# EAGLE schematic MegaFly_rev3.1 (EAGLE 6.1)
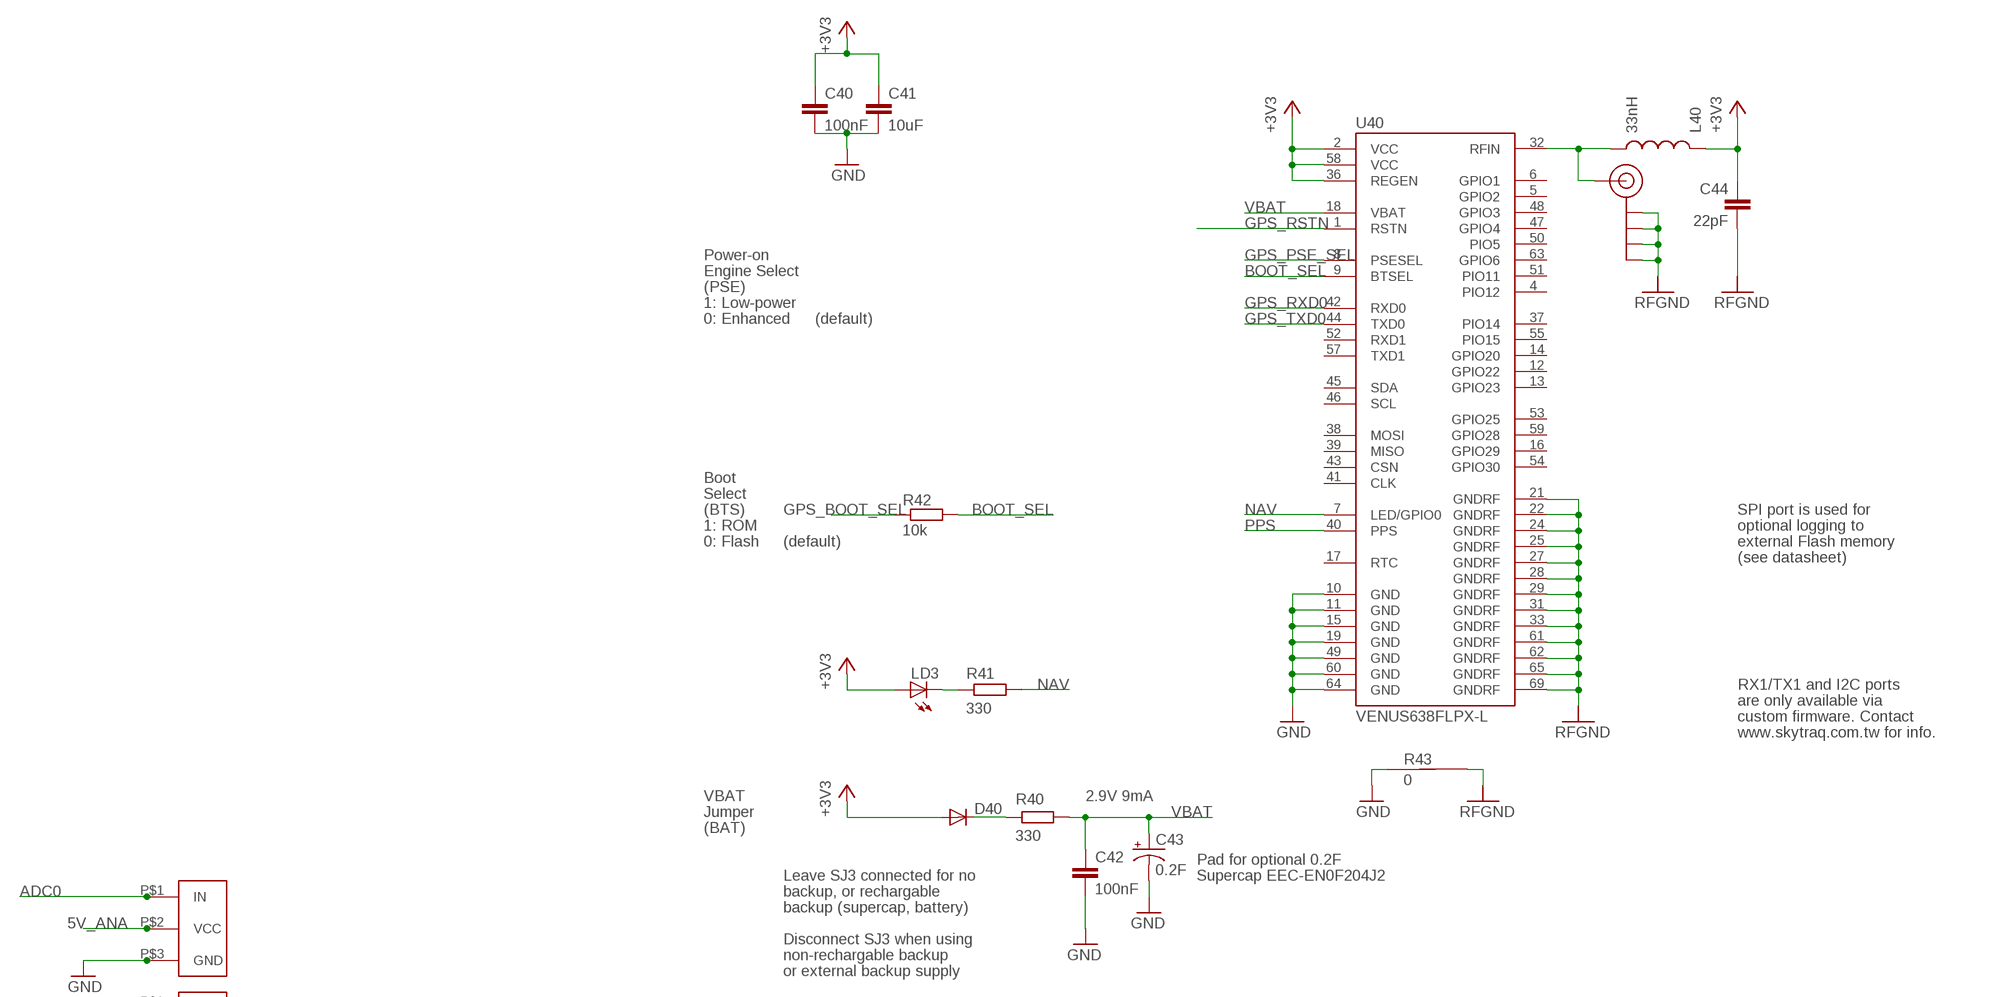
[diagram p0: schematic, sheet 1, part 1 of 3]
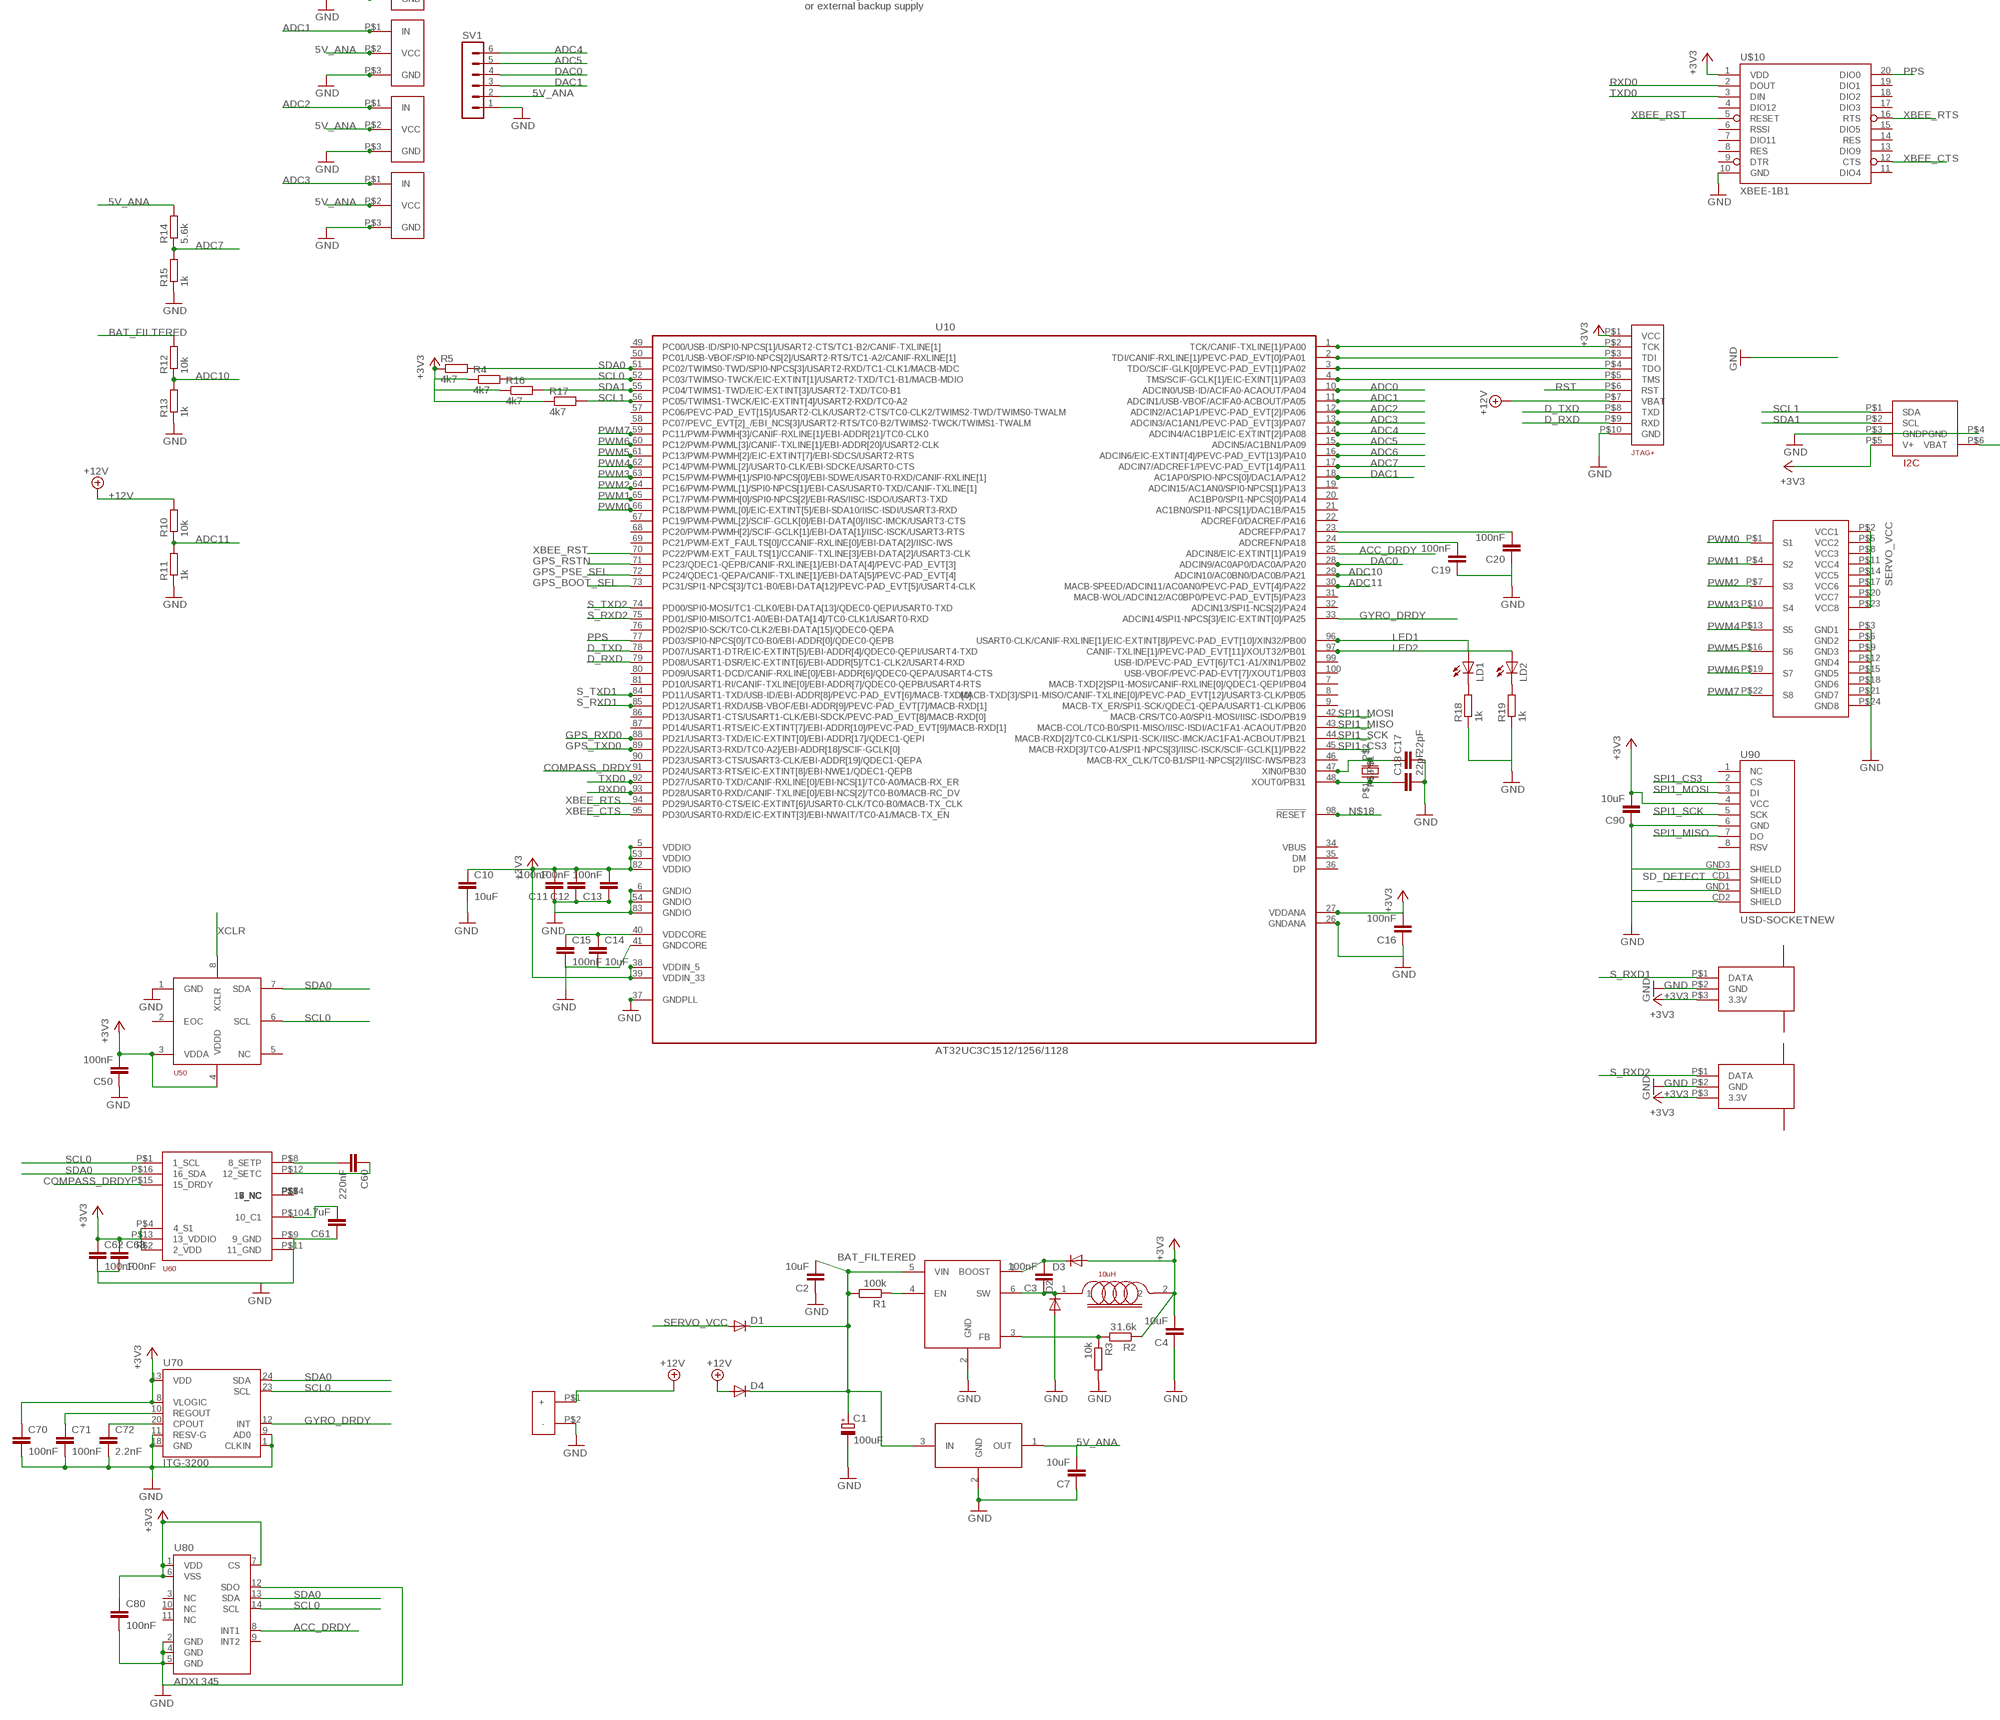
[diagram p1: schematic, sheet 1, part 2 of 3]
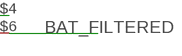
[diagram p2: schematic, sheet 1, part 3 of 3]

## Parts
C1  100uF  CPOL-EUD/7343-31R  [D/7343-31R]
C2  10uF  C-EUC0805  [C0805]
C3  100nF  C-EUC0603  [C0603]
C4  10uF  C-EUC0805  [C0805]
C7  10uF  C-EUC0805  [C0805]
C10  10uF  C-EUC0805  [C0805]
C11  100nF  C-EUC0603  [C0603]
C12  100nF  C-EUC0603  [C0603]
C13  100nF  C-EUC0603  [C0603]
C14  10uF  C-EUC0805  [C0805]
C15  100nF  C-EUC0603  [C0603]
C16  100nF  C-EUC0603  [C0603]
C17  22pF  C-EUC0402  [C0402]
C18  22pF  C-EUC0402  [C0402]
C19  100nF  C-EUC0603  [C0603]
C20  100nF  C-EUC0603  [C0603]
C40  100nF  C-EUC0603  [C0603]
C41  10uF  C-EUC0805  [C0805]
C42  100nF  C-EUC0603  [C0603]
C43  0.2F  CAP_POLEN_J2  [EN_J2]
C44  22pF  C-EUC0402  [C0402]
C50  100nF  C-EUC0603  [C0603]
C60  220nF  C-EUC0805  [C0805]
C61  4.7uF  C-EUC0805  [C0805]
C62  100nF  C-EUC0603  [C0603]
C63  100nF  C-EUC0603  [C0603]
C70  100nF  C-EUC0603  [C0603]
C71  100nF  C-EUC0603  [C0603]
C72  2.2nF  C-EUC0603  [C0603]
C80  100nF  C-EUC0603  [C0603]
C90  10uF  C-EUC0805  [C0805]
D1  DIODESOD  [SOD-323]
D2  DIODESOD  [SOD-323]
D3  DIODESOD  [SOD-323]
D4  DIODESOD  [SOD-323]
D40  DIODESOD  [SOD-323]
JP5  SMA_EDGE  [SMA-EDGE]
L1  10uH  INDUCTOR1210  [C1210]
L40  33nH  INDUCTOR0603  [0603]
LD1  LEDCHIPLED_0805  [CHIPLED_0805]
LD2  LEDCHIPLED_0805  [CHIPLED_0805]
LD3  LEDCHIPLED_0805  [CHIPLED_0805]
R1  100k  R-EU_R0603  [R0603]
R2  31.6k  R-EU_R0603  [R0603]
R3  10k  R-EU_R0603  [R0603]
R4  4k7  R-EU_R0603  [R0603]
R5  4k7  R-EU_R0603  [R0603]
R10  10k  R-EU_R0603  [R0603]
R11  1k  R-EU_R0603  [R0603]
R12  10k  R-EU_R0603  [R0603]
R13  1k  R-EU_R0603  [R0603]
R14  5.6k  R-EU_R0603  [R0603]
R15  1k  R-EU_R0603  [R0603]
R16  4k7  R-EU_R0603  [R0603]
R17  4k7  R-EU_R0603  [R0603]
R18  1k  R-EU_R0603  [R0603]
R19  1k  R-EU_R0603  [R0603]
R40  330  R-EU_R0603  [R0603]
R41  330  R-EU_R0603  [R0603]
R42  10k  R-EU_R0603  [R0603]
R43  0  GND-JUMP  [GND-JUMP]
SV1  MA06-1  [MA06-1]
U1  LM2734  [SOT23-6]
U2  LDO_3PINSOT89_MC78LXX  [SOT89]
U10  AT32UC3C1512/1256/1128  [TQFP100]
U40  VENUS638FLPX-L  [VENUS638FLPX]
U50  BMP085  [BMP085]
U60  HMC5883L  [LPCC16_0.5MM]
U70  ITG-3200  [QFN-24]
U80  ADXL345  [LGA14]
U90  USD-SOCKETNEW  [MICRO-SD-SOCKET-PP]
U$1  AVR32_JTAG+SERIAL  [MOLEX_CONNECTOR_10PINS]
U$3  SERVOCONNECTOR_X8STANDARD  [HEADER3X8]
U$8  CRYSTAL  [SMD_CRYSTAL_ABM]
U$9  POWER  [POWER]
U$10  XBEE-1B1  [XBEE-1]
U$11  SPEKTRUM_RECEIVER  [JST_1.5MM_3WAY]
U$12  SPEKTRUM_RECEIVER  [JST_1.5MM_3WAY]
U$13  SENSOR  [SERVO_COMPACT]
U$15  SENSOR  [SERVO_COMPACT]
U$16  SENSOR  [SERVO_COMPACT]
U$17  SENSOR  [SERVO_COMPACT]
U$18  I2C-BUS  [I2C-HEADER]

## Nets
5V_ANA [power]: C7.2 R14.2 SV1.2 U2.1(OUT) U$13.P$2(VCC) U$15.P$2(VCC) U$16.P$2(VCC) U$17.P$2(VCC)
+3V3 [power]: C4.2 C10.1 C11.2 C12.2 C13.2 C16.2 C40.1 C41.1 C44.1 C50.2 C62.1 C63.1 C70.1 C80.1 C90.2 D3.2(A) D40.2(A) L1.2 L40.1 LD3.A R2.1 R4.1 R5.1 R16.1 R17.1 U10.5(VDDIO) U10.27(VDDANA) U10.38(VDDIN_5) U10.39(VDDIN_33) U10.53(VDDIO) U10.82(VDDIO) U40.2(VCC) U40.36(REGEN) U40.58(VCC) U50.3(VDDA) U50.4(VDDD) U60.P$2(2_VDD) U60.P$4(4_S1) U60.P$13(13_VDDIO) U70.8(VLOGIC) U70.13(VDD) U80.1(VDD) U80.6(VSS) U80.7(CS) U90.4(VCC) U$1.P$1(VCC) U$10.1(VDD) U$11.P$3(3.3V) U$12.P$3(3.3V) U$18.P$5(V+)
+12V [more_power]: D4.2(A) R10.2 U$1.P$7(VBAT) U$9.P$1(+)
ACC_DRDY: U80.8(INT1)
ADC0: U10.10(ADCIN0/USB-ID/ACIFA0-ACAOUT/PA04) U$17.P$1(IN)
ADC1: U10.11(ADCIN1/USB-VBOF/ACIFA0-ACBOUT/PA05) U$16.P$1(IN)
ADC2: U10.12(ADCIN2/AC1AP1/PEVC-PAD_EVT[2]/PA06) U$13.P$1(IN)
ADC3: U10.13(ADCIN3/AC1AN1/PEVC-PAD_EVT[3]/PA07) U$15.P$1(IN)
ADC4: SV1.6 U10.14(ADCIN4/AC1BP1/EIC-EXTINT[2]/PA08)
ADC5: SV1.5 U10.15(ADCIN5/AC1BN1/PA09)
ADC6: U10.16(ADCIN6/EIC-EXTINT[4]/PEVC-PAD_EVT[13]/PA10)
ADC7: R14.1 R15.2 U10.17(ADCIN7/ADCREF1/PEVC-PAD_EVT[14]/PA11)
ADC10: R12.1 R13.2 U10.29(ADCIN10/AC0BN0/DAC0B/PA21)
ADC11: R10.1 R11.2 U10.30(MACB-SPEED/ADCIN11/AC0AN0/PEVC-PAD_EVT[4]/PA22)
ANT: JP5.SIG(SIGNAL) L40.2 U40.32(RFIN)
BAT_FILTERED [power]: C1.+ C2.2 D1.1(C) D4.1(C) R1.2 R12.2 U1.5(VIN) U2.3(IN) U$18.P$6(VBAT)
BOOT_SEL: R42.2 U40.9(BTSEL)
COMPASS_DRDY: U60.P$15(15_DRDY)
D_RXD: U10.79(PD08/USART1-DSR/EIC-EXTINT[6]/EBI-ADDR[5]/TC1-CLK2/USART4-RXD) U$1.P$9(RXD)
D_TXD: U10.78(PD07/USART1-DTR/EIC-EXTINT[5]/EBI-ADDR[4]/QDEC0-QEPI/USART4-TXD) U$1.P$8(TXD)
DAC0: SV1.4 U10.28(ADCIN9/AC0AP0/DAC0A/PA20)
DAC1: SV1.3 U10.18(AC1AP0/SPIO-NPCS[0]/DAC1A/PA12)
GND [power]: C1.- C2.1 C4.1 C7.1 C10.2 C11.1 C12.1 C13.1 C14.2 C15.2 C16.1 C17.2 C18.2 C19.1 C20.1 C40.2 C41.2 C42.2 C43.- C50.1 C61.1 C62.2 C63.2 C70.2 C71.2 C72.2 C80.2 C90.1 D2.2(A) R3.2 R11.1 R13.1 R15.1 R18.1 R19.1 R43.1 SV1.1 U1.2(GND) U2.2(GND) U10.6(GNDIO) U10.26(GNDANA) U10.37(GNDPLL) U10.41(GNDCORE) U10.54(GNDIO) U10.83(GNDIO) U40.10(GND) U40.11(GND) U40.15(GND) U40.19(GND) U40.49(GND) U40.60(GND) U40.64(GND) U50.1(GND) U60.P$9(9_GND) U60.P$11(11_GND) U70.1(CLKIN) U70.9(AD0) U70.11(RESV-G) U70.18(GND) U80.2(GND) U80.4(GND) U80.5(GND) U80.12(SDO) U90.6(GND) U90.CD2(SHIELD) U90.GND1(SHIELD) U90.GND3(SHIELD) U$1.P$10(GND) U$3.P$3(GND1) U$3.P$6(GND2) U$3.P$9(GND3) U$3.P$12(GND4) U$3.P$15(GND5) U$3.P$18(GND6) U$3.P$21(GND7) U$3.P$24(GND8) U$9.P$2(-) U$10.10(GND) U$11.P$2(GND) U$12.P$2(GND) U$13.P$3(GND) U$15.P$3(GND) U$16.P$3(GND) U$17.P$3(GND) U$18.P$3(GND) U$18.P$4(PGND)
GPS_BOOT_SEL: R42.1 U10.73(PC31/SPI1-NPCS[3]/TC1-B0/EBI-DATA[12]/PEVC-PAD_EVT[5]/USART4-CLK)
GPS_PSE_SEL: U10.72(PC24/QDEC1-QEPA/CANIF-TXLINE[1]/EBI-DATA[5]/PEVC-PAD_EVT[4]) U40.8(PSESEL)
GPS_RSTN: U10.71(PC23/QDEC1-QEPB/CANIF-RXLINE[1]/EBI-DATA[4]/PEVC-PAD_EVT[3]) U40.1(RSTN)
GPS_RXD0: U10.88(PD21/USART3-TXD/EIC-EXTINT[0]/EBI-ADDR[17]/QDEC1-QEPI) U40.42(RXD0)
GPS_TXD0: U10.89(PD22/USART3-RXD/TC0-A2]/EBI-ADDR[18]/SCIF-GCLK[0]) U40.44(TXD0)
GYRO_DRDY: U70.12(INT)
LED1: LD1.A U10.96(USART0-CLK/CANIF-RXLINE[1]/EIC-EXTINT[8]/PEVC-PAD_EVT[10]/XIN32/PB00)
LED2: LD2.A U10.97(CANIF-TXLINE[1]/PEVC-PAD_EVT[11]/XOUT32/PB01)
N$1: U10.4(TMS/SCIF-GCLK[1]/EIC-EXINT[1]/PA03) U$1.P$5(TMS)
N$2: U10.3(TDO/SCIF-GLK[0]/PEVC-PAD_EVT[1]/PA02) U$1.P$4(TDO)
N$3: C18.1 U10.48(XOUT0/PB31) U$8.P$1
N$4: C17.1 U10.47(XIN0/PB30) U$8.P$2
N$5: LD1.C R18.2
N$6: R1.1 U1.4(EN)
N$7: LD2.C R19.2
N$8 [power]: C3.1 D2.1(C) L1.1 U1.6(SW)
N$9 [power]: R2.2 R3.1 U1.3(FB)
N$10: C3.2 D3.1(C) U1.1(BOOST)
N$11: C72.1 U70.20(CPOUT)
N$12: C61.2 U60.P$10(10_C1)
N$13: C60.2 U60.P$8(8_SETP)
N$14: C60.1 U60.P$12(12_SETC)
N$15: C71.1 U70.10(REGOUT)
N$16: LD3.C R41.1
N$17: U10.2(TDI/CANIF-RXLINE[1]/PEVC-PAD_EVT[0]/PA01) U$1.P$3(TDI)
N$18: U10.98(!RESET)
N$19: C14.1 C15.1 U10.40(VDDCORE)
N$20: D40.1(C) R40.1
N$29: U10.1(TCK/CANIF-TXLINE[1]/PA00) U$1.P$2(TCK)
N$31: C19.2 U10.24(ADCREFN/PA18)
N$32: C20.2 U10.23(ADCREFP/PA17)
NAV: R41.2 U40.7(LED/GPIO0)
PPS: U10.77(PD03/SPI0-NPCS[0]/TC0-B0/EBI-ADDR[0]/QDEC0-QEPB) U40.40(PPS) U$10.20(DIO0)
PWM0: U10.66(PC18/PWM-PWML[0]/EIC-EXTINT[5]/EBI-SDA10/IISC-ISDI/USART3-RXD) U$3.P$1(S1)
PWM1: U10.65(PC17/PWM-PWMH[0]/SPI0-NPCS[2]/EBI-RAS/IISC-ISDO/USART3-TXD) U$3.P$4(S2)
PWM2: U10.64(PC16/PWM-PWML[1]/SPI0-NPCS[1]/EBI-CAS/USART0-TXD/CANIF-TXLINE[1]) U$3.P$7(S3)
PWM3: U10.63(PC15/PWM-PWMH[1]/SPI0-NPCS[0]/EBI-SDWE/USART0-RXD/CANIF-RXLINE[1]) U$3.P$10(S4)
PWM4: U10.62(PC14/PWM-PWML[2]/USART0-CLK/EBI-SDCKE/USART0-CTS) U$3.P$13(S5)
PWM5: U10.61(PC13/PWM-PWMH[2]/EIC-EXTINT[7]/EBI-SDCS/USART2-RTS) U$3.P$16(S6)
PWM6: U10.60(PC12/PWM-PWML[3]/CANIF-TXLINE[1]/EBI-ADDR[20]/USART2-CLK) U$3.P$19(S7)
PWM7: U10.59(PC11/PWM-PWMH[3]/CANIF-RXLINE[1]/EBI-ADDR[21]/TC0-CLK0) U$3.P$22(S8)
RFGND: C44.2 JP5.GND@0(GND) JP5.GND@1(GND) JP5.GND@2(GND) JP5.GND@3(GND) R43.2 U40.21(GNDRF) U40.22(GNDRF) U40.24(GNDRF) U40.25(GNDRF) U40.27(GNDRF) U40.28(GNDRF) U40.29(GNDRF) U40.31(GNDRF) U40.33(GNDRF) U40.61(GNDRF) U40.62(GNDRF) U40.65(GNDRF) U40.69(GNDRF)
RST: U$1.P$6(RST)
RXD0: U10.93(PD28/USART0-RXD/CANIF-TXLINE[0]/EBI-NCS[2]/TC0-B0/MACB-RC_DV) U$10.2(DOUT)
S_RXD1: U10.85(PD12/USART1-RXD/USB-VBOF/EBI-ADDR[9]/PEVC-PAD_EVT[7]/MACB-RXD[1]) U$11.P$1(DATA)
S_RXD2: U10.75(PD01/SPI0-MISO/TC1-A0/EBI-DATA[14]/TC0-CLK1/USART0-RXD) U$12.P$1(DATA)
S_TXD1: U10.84(PD11/USART1-TXD/USB-ID/EBI-ADDR[8]/PEVC-PAD_EVT[6]/MACB-TXD[0])
S_TXD2: U10.74(PD00/SPI0-MOSI/TC1-CLK0/EBI-DATA[13]/QDEC0-QEPI/USART0-TXD)
SCL0: R4.2 U10.52(PC03/TWIMSO-TWCK/EIC-EXTINT[1]/USART2-TXD/TC1-B1/MACB-MDIO) U50.6(SCL) U60.P$1(1_SCL) U70.23(SCL) U80.14(SCL)
SCL1: R17.2 U10.56(PC05/TWIMS1-TWCK/EIC-EXTINT[4]/USART2-RXD/TC0-A2) U$18.P$1(SDA)
SD_DETECT: U90.CD1(SHIELD)
SDA0: R5.2 U10.51(PC02/TWIMS0-TWD/SPI0-NPCS[3]/USART2-RXD/TC1-CLK1/MACB-MDC) U50.7(SDA) U60.P$16(16_SDA) U70.24(SDA) U80.13(SDA)
SDA1: R16.2 U10.55(PC04/TWIMS1-TWD/EIC-EXTINT[3]/USART2-TXD/TC0-B1) U$18.P$2(SCL)
SERVO_VCC [more_power]: D1.2(A) U$3.P$2(VCC1) U$3.P$5(VCC2) U$3.P$8(VCC3) U$3.P$11(VCC4) U$3.P$14(VCC5) U$3.P$17(VCC6) U$3.P$20(VCC7) U$3.P$23(VCC8)
SPI1_CS3: U10.45(MACB-RXD[3]/TC0-A1/SPI1-NPCS[3]/IISC-ISCK/SCIF-GCLK[1]/PB22) U90.2(CS)
SPI1_MISO: U10.43(MACB-COL/TC0-B0/SPI1-MISO/IISC-ISDI/AC1FA1-ACAOUT/PB20) U90.7(DO)
SPI1_MOSI: U10.42(MACB-CRS/TC0-A0/SPI1-MOSI/IISC-ISDO/PB19) U90.3(DI)
SPI1_SCK: U10.44(MACB-RXD[2]/TC0-CLK1/SPI1-SCK/IISC-IMCK/AC1FA1-ACBOUT/PB21) U90.5(SCK)
TXD0: U10.92(PD27/USART0-TXD/CANIF-RXLINE[0]/EBI-NCS[1]/TC0-A0/MACB-RX_ER) U$10.3(DIN)
VBAT: C42.1 C43.+ R40.2 U40.18(VBAT)
XBEE_CTS: U10.95(PD30/USART0-RXD/EIC-EXTINT[3]/EBI-NWAIT/TC0-A1/MACB-TX_EN) U$10.12(CTS)
XBEE_RST: U10.70(PC22/PWM-EXT_FAULTS[1]/CCANIF-TXLINE[3]/EBI-DATA[2]/USART3-CLK) U$10.5(RESET)
XBEE_RTS: U10.94(PD29/USART0-CTS/EIC-EXTINT[6]/USART0-CLK/TC0-B0/MACB-TX_CLK) U$10.16(RTS)
XCLR: U50.8(XCLR)
Unconnected: U10.7(MACB-TXD[2]SPI1-MOSI/CANIF-RXLINE[0]/QDEC1-QEPI/PB04) U10.8(MACB-TXD[3]/SPI1-MISO/CANIF-TXLINE[0]/PEVC-PAD_EVT[12]/USART3-CLK/PB05) U10.9(MACB-TX_ER/SPI1-SCK/QDEC1-QEPA/USART1-CLK/PB06) U10.19(ADCIN15/AC1AN0/SPI0-NPCS[1]/PA13) U10.20(AC1BP0/SPI1-NPCS[0]/PA14) U10.21(AC1BN0/SPI1-NPCS[1]/DAC1B/PA15) U10.22(ADCREF0/DACREF/PA16) U10.25(ADCIN8/EIC-EXTINT[1]/PA19) U10.31(MACB-WOL/ADCIN12/AC0BP0/PEVC-PAD_EVT[5]/PA23) U10.32(ADCIN13/SPI1-NCS[2]/PA24) U10.33(ADCIN14/SPI1-NPCS[3]/EIC-EXTINT[0]/PA25) U10.34(VBUS) U10.35(DM) U10.36(DP) U10.46(MACB-RX_CLK/TC0-B1/SPI1-NPCS[2]/IISC-IWS/PB23) U10.49(PC00/USB-ID/SPI0-NPCS[1]/USART2-CTS/TC1-B2/CANIF-TXLINE[1]) U10.50(PC01/USB-VBOF/SPI0-NPCS[2]/USART2-RTS/TC1-A2/CANIF-RXLINE[1]) U10.57(PC06/PEVC-PAD_EVT[15]/USART2-CLK/USART2-CTS/TC0-CLK2/TWIMS2-TWD/TWIMS0-TWALM) U10.58(PC07/PEVC_EVT[2]_/EBI_NCS[3]/USART2-RTS/TC0-B2/TWIMS2-TWCK/TWIMS1-TWALM) U10.67(PC19/PWM-PWML[2]/SCIF-GCLK[0]/EBI-DATA[0]/IISC-IMCK/USART3-CTS) U10.68(PC20/PWM-PWMH[2]/SCIF-GCLK[1]/EBI-DATA[1]/IISC-ISCK/USART3-RTS) U10.69(PC21/PWM-EXT_FAULTS[0]/CCANIF-RXLINE[0]/EBI-DATA[2]/IISC-IWS) U10.76(PD02/SPI0-SCK/TC0-CLK2/EBI-DATA[15]/QDEC0-QEPA) U10.80(PD09/USART1-DCD/CANIF-RXLINE[0]/EBI-ADDR[6]/QDEC0-QEPA/USART4-CTS) U10.81(PD10/USART1-RI/CANIF-TXLINE[0]/EBI-ADDR[7]/QDEC0-QEPB/USART4-RTS) U10.86(PD13/USART1-CTS/USART1-CLK/EBI-SDCK/PEVC-PAD_EVT[8]/MACB-RXD[0]) U10.87(PD14/USART1-RTS/EIC-EXTINT[7]/EBI-ADDR[10]/PEVC-PAD_EVT[9]/MACB-RXD[1]) U10.90(PD23/USART3-CTS/USART3-CLK/EBI-ADDR[19]/QDEC1-QEPA) U10.91(PD24/USART3-RTS/EIC-EXTINT[8]/EBI-NWE1/QDEC1-QEPB) U10.99(USB-ID/PEVC-PAD_EVT[6]/TC1-A1/XIN1/PB02) U10.100(USB-VBOF/PEVC-PAD-EVT[7]/XOUT1/PB03) U40.4(PIO12) U40.5(GPIO2) U40.6(GPIO1) U40.12(GPIO22) U40.13(GPIO23) U40.14(GPIO20) U40.16(GPIO29) U40.17(RTC) U40.37(PIO14) U40.38(MOSI) U40.39(MISO) U40.41(CLK) U40.43(CSN) U40.45(SDA) U40.46(SCL) U40.47(GPIO4) U40.48(GPIO3) U40.50(PIO5) U40.51(PIO11) U40.52(RXD1) U40.53(GPIO25) U40.54(GPIO30) U40.55(PIO15) U40.57(TXD1) U40.59(GPIO28) U40.63(GPIO6) U50.2(EOC) U50.5(NC) U60.P$3(3_NC) U60.P$5(5_NC) U60.P$6(6_NC) U60.P$7(7_NC) U60.P$14(14_NC) U80.3(NC) U80.9(INT2) U80.10(NC) U80.11(NC) U90.1(NC) U90.8(RSV) U$10.4(DIO12) U$10.6(RSSI) U$10.7(DIO11) U$10.8(RES) U$10.9(DTR) U$10.11(DIO4) U$10.13(DIO9) U$10.14(RES) U$10.15(DIO5) U$10.17(DIO3) U$10.18(DIO2) U$10.19(DIO1)

## Notes on the sheet
- Power-on
- Engine Select
- (PSE)
- 1: Low-power | RFGND | RFGND
- 0: Enhanced | (default)
- Boot
- Select
- (BTS) | SPI port is used for
- 1: ROM | optional logging to
- 0: Flash | (default) | external Flash memory
- (see datasheet)
- RX1/TX1 and I2C ports
- are only available via
- custom firmware. Contact
- RFGND | www.skytraq.com.tw for info.
- VBAT | 2.9V 9mA
- Jumper | RFGND
- (BAT)
- Pad for optional 0.2F
- Leave SJ3 connected for no | Supercap EEC-EN0F204J2
- backup, or rechargable
- backup (supercap, battery)
- Disconnect SJ3 when using
- non-rechargable backup
- or external backup supply

## Library data of the parts
C1 = rcl:CPOL-EU: POLARIZED CAPACITOR, European symbol
C2-C4 C7 C10-C20 C40-C42 C44 C50 C60-C63 C70-C72 C80 C90 = rcl:C-EU: CAPACITOR, European symbol
C43 = SparkFun:CAP_POL: Capacitor Polarized These are standard SMD and PTH capacitors. Normally 10uF, 47uF, and 100uF in electrolytic and tantalum varieties. Always verify the external diameter of the through hole cap, it varies with capacity, voltage, and manufacturer. The EIA devices should be standard.
D1-D4 D40 = SparkFun:DIODE: Diode These are standard reverse protection diodes and small signal diodes. SMA package can handle up to about 1A. SOD-323 can handle about 200mA. What the SOD-323 package when ordering, there are some mfgs out there that are 5-pin packages.
JP5 = SparkFun:SMA_EDGE: SMA Antenna Connector End launch SMA connector. The paste layer has been removed so that the connector can be hand soldered onto the board after reflow.
L1 = power:INDUCTOR
L40 = SparkFun:INDUCTOR: Inductors Basic Inductor/Choke - 0603 and 1206. Footprints are not proven and vary greatly between part numbers.
LD1-LD3 = led:LED: LED OSRAM: - CHIPLED LG R971, LG N971, LY N971, LG Q971, LY Q971, LO R971, LY R971 LH N974, LH R974 LS Q976, LO Q976, LY Q976 LO Q996 - Hyper CHIPLED LW Q18S LB Q993, LB Q99A, LB R99A - SideLED LS A670, LO A670, LY A670, LG A670, LP A670 LB A673, LV A673, LT A673, LW A673 LH A674 LY A675 LS A676, LA A676, LO A676, LY A676, LW A676 LS A679, LY A679, LG A679 - Hyper Micro SIDELED® LS Y876, LA Y876, LO Y876, LY Y876 LT Y87S - SmartLED LW L88C, LW L88S LB L89C, LB L89S, LG L890 LS L89K, LO L89K, LY L89K LS L896, LA L896, LO L896, LY L896 - TOPLED LS T670, LO T670, LY T670, LG T670, LP T670 LSG T670, LSP T670, LSY T670, LOP T670, LYG T670 LG T671, LOG T671, LSG T671 LB T673, LV T673, LT T673, LW T673 LH T674 LS T676, LA T676, LO T676, LY T676, LB T676, LH T676, LSB T676, LW T676 LB T67C, LV T67C, LT T67C, LS T67K, LO T67K, LY T67K, LW E67C LS E67B, LA E67B, LO E67B, LY E67B, LB E67C, LV E67C, LT E67C LW T67C LS T679, LY T679, LG T679 LS T770, LO T770, LY T770, LG T770, LP T770 LB T773, LV T773, LT T773, LW T773 LH T774 LS E675, LA E675, LY E675, LS T675 LS T776, LA T776, LO T776, LY T776, LB T776 LHGB T686 LT T68C, LB T68C - Hyper Mini TOPLED® LB M676 - Mini TOPLED Santana® LG M470 LS M47K, LO M47K, LY M47K Source: http://www.osram.convergy.de LUXEON: - LUMILED® LXK2-PW12-R00, LXK2-PW12-S00, LXK2-PW14-U00, LXK2-PW14-V00 LXK2-PM12-R00, LXK2-PM12-S00, LXK2-PM14-U00 LXK2-PE12-Q00, LXK2-PE12-R00, LXK2-PE12-S00, LXK2-PE14-T00, LXK2-PE14-U00 LXK2-PB12-K00, LXK2-PB12-L00, LXK2-PB12-M00, LXK2-PB14-N00, LXK2-PB14-P00, LXK2-PB14-Q00 LXK2-PR12-L00, LXK2-PR12-M00, LXK2-PR14-Q00, LXK2-PR14-R00 LXK2-PD12-Q00, LXK2-PD12-R00, LXK2-PD12-S00 LXK2-PH12-R00, LXK2-PH12-S00 LXK2-PL12-P00, LXK2-PL12-Q00, LXK2-PL12-R00 Source: www.luxeon.com KINGBRIGHT: KA-3528ASYC Source: www.kingbright.com
R1-R5 R10-R19 R40-R42 = rcl:R-EU_: RESISTOR, European symbol
R43 = mike-temp:GND-JUMP: Zero-Ohm trace for connecting different ground planes at a single point.
SV1 = con-special_purpose:MA06-1: PIN HEADER; OC_FARNELL: unknown; OC_NEWARK: unknown
U1 = power:LM2734
U2 = power:LDO_3PIN
U10 = atmel-avr32-michel:AT32UC3C1512/1256/1128: AT32UC3C1512/1256/1128
U40 = mike-temp:VENUS638FLPX-L: Venus638FLPX-L GPS Receiver Venus638FLPx is a high performance, low cost, single chip GPS receiver targeting mobile consumer and cellular handset applications. It offers very low power consumption, high sensitivity, and best in class signal acquisition and time-to-first-fix performance. Venus638FLPx contains all the necessary components of a complete GPS receiver, includes 1.2dB cascaded system NF RF front-end, GPS baseband signal processor, 0.5ppm TCXO, 32.768kHz RTC crystal, RTC LDO regulator, and passive components. It requires very low external component count and takes up only 100mm2 PCB footprint. Dedicated massive-correlator signal parameter search engine within the baseband enables rapid search of all the available satellites and acquisition of very weak signal. An advanced track engine allows weak signal tracking and positioning in harsh environments such as urban canyons and under deep foliage. The self-contained architecture keeps GPS processing off the host and allows integration into applications with very little resource. FEATURES 20Hz update rate -148dBm cold start sensitivity -165dBm tracking sensitivity 29 second cold start TTFF 3.5 second TTFF with AGPS 1 second hot start 2.5m accuracy Multipath detection and suppression Jamming detection and mitigation SBAS (WAAS / EGNOS) support 7-day extended ephemeris AGPS 67mW full power navigation Works directly with active or passive antenna Internal flash for optional 75K point data logging Supports external SPI flash memory data logging Complete receiver in 10mm x 10mm x 1.3mm size Contains LNA, SAW Filter, TCXO, RTC Xtal, LDO Pb-free RoHS compliant
U50 = SpecialIC:BMP085
U60 = SpecialIC:HMC5883L
U70 = SparkFun:ITG-3200: ITG-3200 3-axis gyro, digital output, qfn24 package
U80 = SparkFun:ADXL345
U90 = SparkFun:USD-SOCKET: microSD Socket Push-push type uSD socket. Schematic element and footprint production proven. Spark Fun Electronics SKU : PRT-00127. tDoc lines correctly indicate media card edge positions when inserting (unlocked, locked, depressed).
U$1 = con-special_purpose:AVR32_JTAG+SERIAL: Unified compact debug port with JTAG, 7-12V power supply (VBAT) and serial port.
U$3 = con-special_purpose:SERVOCONNECTOR_X8
U$8 = Atmel_utils:CRYSTAL
U$9 = con-special_purpose:POWER
U$10 = SparkFun2010:XBEE-1
U$11 U$12 = con-special_purpose:SPEKTRUM_RECEIVER
U$13 U$15-U$17 = con-special_purpose:SENSOR
U$18 = con-special_purpose:I2C-BUS

## Net classes
0 default: width 0.15 mm, drill 0.35 mm, clearance 0.15 mm
1 power: width 0.25 mm, drill 0.35 mm, clearance 0.15 mm
2 more_power: width 0.5 mm, drill 0.5 mm, clearance 0.15 mm